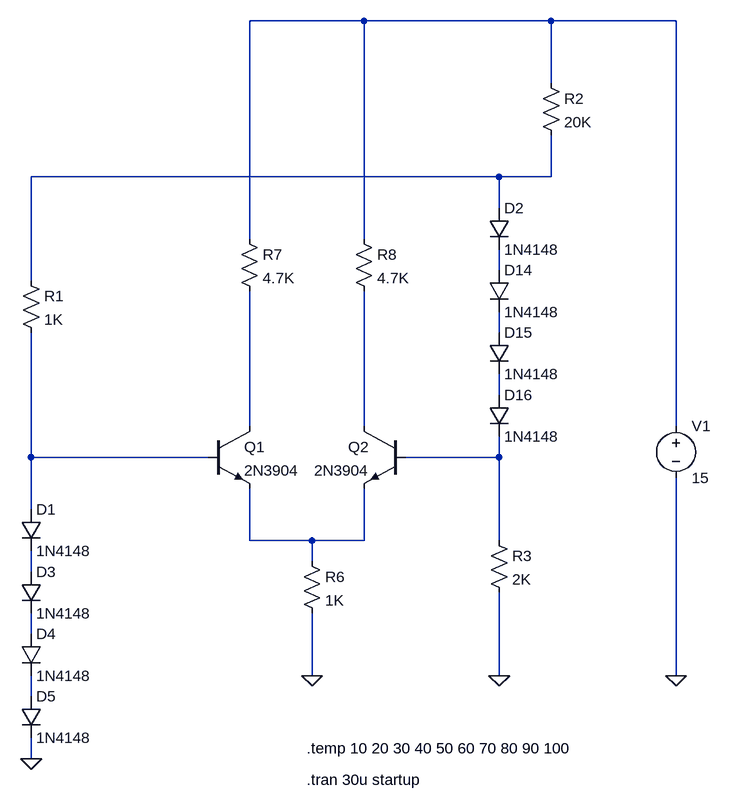
[diagram p0: schematic thermometer2.asc]
thermometer2.asc, the LTspice schematic file:
Version 4
SHEET 1 1504 680
WIRE 384 -672 208 -672
WIRE 672 -672 384 -672
WIRE 864 -672 672 -672
WIRE 672 -576 672 -672
WIRE 592 -432 -128 -432
WIRE 672 -432 672 -496
WIRE 672 -432 592 -432
WIRE 592 -384 592 -432
WIRE 208 -336 208 -672
WIRE 384 -336 384 -672
WIRE 592 -288 592 -320
WIRE -128 -272 -128 -432
WIRE 592 -192 592 -224
WIRE 592 -96 592 -128
WIRE 208 -48 208 -256
WIRE 384 -48 384 -256
WIRE 864 -48 864 -672
WIRE -128 0 -128 -192
WIRE 144 0 -128 0
WIRE 592 0 592 -32
WIRE 592 0 448 0
WIRE -128 80 -128 0
WIRE 208 128 208 48
WIRE 304 128 208 128
WIRE 384 128 384 48
WIRE 384 128 304 128
WIRE 592 128 592 0
WIRE 304 160 304 128
WIRE -128 176 -128 144
WIRE -128 272 -128 240
WIRE 304 336 304 240
WIRE 592 336 592 208
WIRE 864 336 864 32
WIRE -128 368 -128 336
WIRE -128 464 -128 432
FLAG 864 336 0
FLAG 304 336 0
FLAG -128 464 0
FLAG 592 336 0
SYMBOL diode -144 80 R0
SYMATTR InstName D1
SYMATTR Value 1N4148
SYMBOL res -144 -288 R0
SYMATTR InstName R1
SYMATTR Value 1K
SYMBOL res 656 -592 R0
SYMATTR InstName R2
SYMATTR Value 20K
SYMBOL voltage 864 -64 R0
WINDOW 123 0 0 Left 2
WINDOW 39 0 0 Left 2
SYMATTR InstName V1
SYMATTR Value 15
SYMBOL npn 144 -48 R0
SYMATTR InstName Q1
SYMATTR Value 2N3904
SYMBOL npn 448 -48 M0
SYMATTR InstName Q2
SYMATTR Value 2N3904
SYMBOL res 288 144 R0
SYMATTR InstName R6
SYMATTR Value 1K
SYMBOL res 192 -352 R0
SYMATTR InstName R7
SYMATTR Value 4.7K
SYMBOL res 368 -352 R0
SYMATTR InstName R8
SYMATTR Value 4.7K
SYMBOL diode -144 176 R0
SYMATTR InstName D3
SYMATTR Value 1N4148
SYMBOL diode -144 272 R0
SYMATTR InstName D4
SYMATTR Value 1N4148
SYMBOL diode -144 368 R0
SYMATTR InstName D5
SYMATTR Value 1N4148
SYMBOL diode 576 -384 R0
SYMATTR InstName D2
SYMATTR Value 1N4148
SYMBOL res 576 112 R0
SYMATTR InstName R3
SYMATTR Value 2K
SYMBOL diode 576 -288 R0
SYMATTR InstName D14
SYMATTR Value 1N4148
SYMBOL diode 576 -192 R0
SYMATTR InstName D15
SYMATTR Value 1N4148
SYMBOL diode 576 -96 R0
SYMATTR InstName D16
SYMATTR Value 1N4148
TEXT 296 448 Left 2 !.temp 10 20 30 40 50 60 70 80 90 100
TEXT 296 496 Left 2 !.tran 30u startup

The netlist it stands for:
* thermometer2.asc
D1 N008 N011 1N4148
R1 N002 N008 1K
R2 N001 N002 20K
V1 N001 0 15
Q1 N006 N008 N010 0 2N3904
Q2 N007 N009 N010 0 2N3904
R6 N010 0 1K
R7 N001 N006 4.7K
R8 N001 N007 4.7K
D3 N011 N012 1N4148
D4 N012 N013 1N4148
D5 N013 0 1N4148
D2 N002 N003 1N4148
R3 N009 0 2K
D14 N003 N004 1N4148
D15 N004 N005 1N4148
D16 N005 N009 1N4148
.model D D
.lib standard.dio
.model NPN NPN
.model PNP PNP
.lib standard.bjt
.temp 10 20 30 40 50 60 70 80 90 100
.tran 30u startup
.backanno
.end